# Altium project PCB_Project.PrjPcb
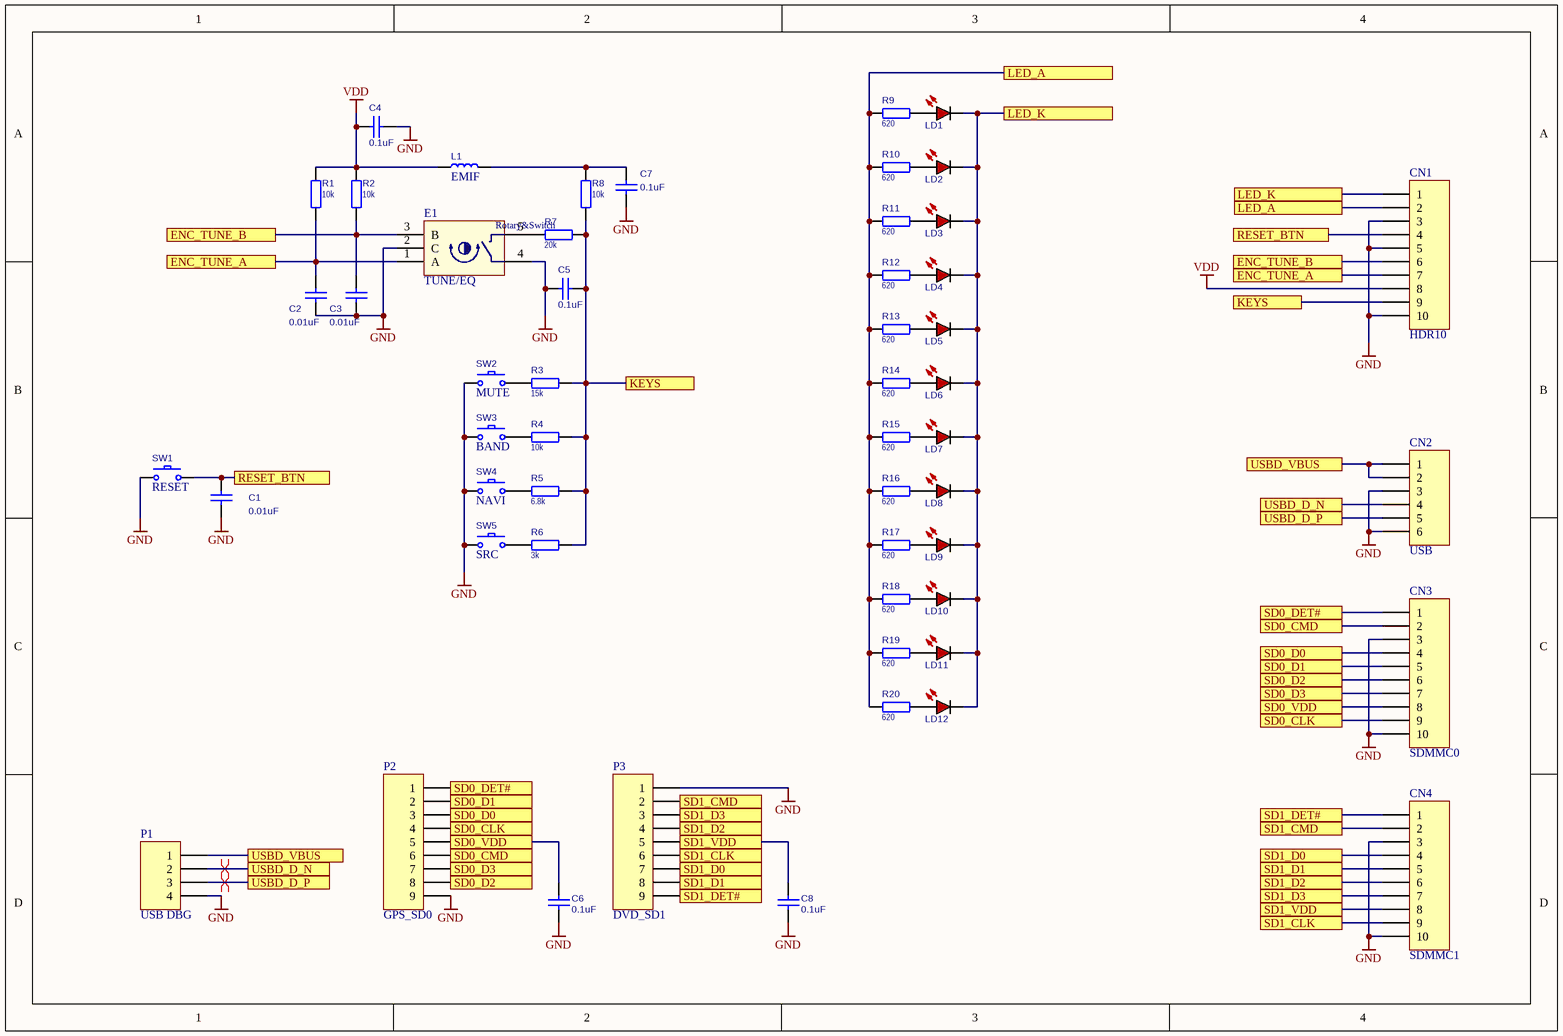
[diagram p0: right_panel.SchDoc]
1 sheet, 54 parts. Net scope: flat (ports and power ports of the same name join across sheets).
Board file: PCB.PcbDoc

## Sheet right_panel.SchDoc
size A4

### Parts
C1  value 0.01uF  [C0603]  (hidden comment: CL10B103KB8NNNC)
C2  value 0.01uF  [C0603]  (hidden comment: CL10B103KB8NNNC)
C3  value 0.01uF  [C0603]  (hidden comment: CL10B103KB8NNNC)
C4  value 0.1uF  [C0603]  (hidden comment: CC0603KRX7R9BB104)
C5  value 0.1uF  [C0603]  (hidden comment: C1608X7R1H104K080AA)
C6  value 0.1uF  [C0603]  (hidden comment: C1608X7R1H104K080AA)
C7  value 0.1uF  [C0603]  (hidden comment: C1608X7R1H104K080AA)
C8  value 0.1uF  [C0603]  (hidden comment: C1608X7R1H104K080AA)
CN1  HDR10  [10S-0.5SH]
CN2  USB  [6S-0.5SH]
CN3  SDMMC0  [10S-0.5SH]
CN4  SDMMC1  [10S-0.5SH]
E1  TUNE/EQ  [Rotary Encoder]
L1  value EMIF  [IND0603]  (hidden comment: BLM18AG102SN1D)
LD1  LED_R  [LED0805]  (value not drawn)
LD2  LED_R  [LED0805]  (value not drawn)
LD3  LED_R  [LED0805]  (value not drawn)
LD4  LED_R  [LED0805]  (value not drawn)
LD5  LED_R  [LED0805]  (value not drawn)
LD6  LED_R  [LED0805]  (value not drawn)
LD7  LED_R  [LED0805]  (value not drawn)
LD8  LED_R  [LED0805]  (value not drawn)
LD9  LED_R  [LED0805]  (value not drawn)
LD10  LED_R  [LED0805]  (value not drawn)
LD11  LED_R  [LED0805]  (value not drawn)
LD12  LED_R  [LED0805]  (value not drawn)
P1  USB DBG  [CUSTOM-4-PADS-2.54]
P2  GPS_SD0  [CUSTOM-9-PADS-1.5]
P3  DVD_SD1  [CUSTOM-9-PADS-1.5]
R1  10k  [R0603]
R2  10k  [R0603]
R3  15k  [R0603]
R4  10k  [R0603]
R5  6.8k  [R0603]
R6  3k  [R0603]
R7  20k  [R0603]
R8  10k  [R0603]
R9  620  [R0603]
R10  620  [R0603]
R11  620  [R0603]
R12  620  [R0603]
R13  620  [R0603]
R14  620  [R0603]
R15  620  [R0603]
R16  620  [R0603]
R17  620  [R0603]
R18  620  [R0603]
R19  620  [R0603]
R20  620  [R0603]
SW1  RESET  [TACTM-34N-F]
SW2  MUTE  [6X6-SMT-2PIN]
SW3  BAND  [6X6-SMT-2PIN]
SW4  NAVI  [6X6-SMT-2PIN]
SW5  SRC  [6X6-SMT-2PIN]

### Ports
ENC_TUNE_A, ENC_TUNE_B, KEYS, LED_A, LED_K, RESET_BTN, SD0_CLK, SD0_CMD, SD0_D0, SD0_D1, SD0_D2, SD0_D3, SD0_DET#, SD0_VDD, SD1_CLK, SD1_CMD, SD1_D0, SD1_D1, SD1_D2, SD1_D3, SD1_DET#, SD1_VDD, USBD_D_N, USBD_D_P, USBD_VBUS

### Nets
GND: C1.1 C2.1 C3.1 C4.2 C5.1 C6.1 C7.2 C8.1 CN1.3 CN1.5 CN1.10 CN2.3 CN2.6 CN3.3 CN3.10 CN4.3 CN4.10 E1.2(C) E1.4(SW) P1.4 P2.9 P3.1 SW1.1 SW2.1 SW3.1 SW4.1 SW5.1
VDD: C4.1 CN1.8 L1.2 R1.2 R2.1
ENC_TUNE_A: C2.2 CN1.7 E1.1(A) R1.1 ; port ENC_TUNE_A
ENC_TUNE_B: C3.2 CN1.6 E1.3(B) R2.2 ; port ENC_TUNE_B
KEYS: C5.2 CN1.9 R3.2 R4.2 R5.2 R6.2 R7.1 R8.1 ; port KEYS
LED_A: CN1.2 R9.1 R10.1 R11.1 R12.1 R13.1 R14.1 R15.1 R16.1 R17.1 R18.1 R19.1 R20.1 ; port LED_A
LED_K: CN1.1 LD1.1 LD2.1 LD3.1 LD4.1 LD5.1 LD6.1 LD7.1 LD8.1 LD9.1 LD10.1 LD11.1 LD12.1 ; port LED_K
RESET_BTN: C1.2 CN1.4 SW1.2 ; port RESET_BTN
SD0_CLK: CN3.9 P2.4 ; port SD0_CLK
SD0_CMD: CN3.2 P2.6 ; port SD0_CMD
SD0_D0: CN3.4 P2.3 ; port SD0_D0
SD0_D1: CN3.5 P2.2 ; port SD0_D1
SD0_D2: CN3.6 P2.8 ; port SD0_D2
SD0_D3: CN3.7 P2.7 ; port SD0_D3
SD0_DET#: CN3.1 P2.1 ; port SD0_DET#
SD0_VDD: C6.2 CN3.8 P2.5 ; port SD0_VDD
SD1_CLK: CN4.9 P3.6 ; port SD1_CLK
SD1_CMD: CN4.2 P3.2 ; port SD1_CMD
SD1_D0: CN4.4 P3.7 ; port SD1_D0
SD1_D1: CN4.5 P3.8 ; port SD1_D1
SD1_D2: CN4.6 P3.4 ; port SD1_D2
SD1_D3: CN4.7 P3.3 ; port SD1_D3
SD1_DET#: CN4.1 P3.9 ; port SD1_DET#
SD1_VDD: C8.2 CN4.8 P3.5 ; port SD1_VDD
USBD_D_N: CN2.4 P1.2 ; port USBD_D_N
USBD_D_P: CN2.5 P1.3 ; port USBD_D_P
USBD_VBUS: CN2.1 CN2.2 P1.1 ; port USBD_VBUS
NetC7_1: C7.1 L1.1 R8.2
NetE1_5: E1.5(SW) R7.2
NetLD1_2: LD1.2 R9.2
NetLD2_2: LD2.2 R10.2
NetLD3_2: LD3.2 R11.2
NetLD4_2: LD4.2 R12.2
NetLD5_2: LD5.2 R13.2
NetLD6_2: LD6.2 R14.2
NetLD7_2: LD7.2 R15.2
NetLD8_2: LD8.2 R16.2
NetLD9_2: LD9.2 R17.2
NetLD10_2: LD10.2 R18.2
NetLD11_2: LD11.2 R19.2
NetLD12_2: LD12.2 R20.2
NetR3_1: R3.1 SW2.2
NetR4_1: R4.1 SW3.2
NetR5_1: R5.1 SW4.2
NetR6_1: R6.1 SW5.2

### Layout directives
differential pair: USBD_D_N, USBD_D_P

### Notes on the sheet
- (in symbol ENC_SW) Rotary&Switch

### Library data of the parts
C1-C8 = CAP_NPOL
CN1 CN3 CN4 = HDR 10: Header, 10-Pin; LatestRevisionDate: 17-Jul-2002; LatestRevisionNote: Re-released for DXP Platform.; Publisher: Altium Limited
CN2 = HDR 6: Header, 6-Pin; LatestRevisionDate: 17-Jul-2002; LatestRevisionNote: Re-released for DXP Platform.; Publisher: Altium Limited
E1 = ENC_SW
L1 = IND_WO_IRON
LD1-LD12 = LED_RED: LED Red; Value: *
P1 = HDR 4: Header, 4-Pin; LatestRevisionDate: 17-Jul-2002; LatestRevisionNote: Re-released for DXP Platform.; Publisher: Altium Limited
P2 P3 = HDR 9: Header, 9-Pin; LatestRevisionDate: 17-Jul-2002; LatestRevisionNote: Re-released for DXP Platform.; Publisher: Altium Limited
R1-R20 = RESISTOR: RES
  R1 R2 R4 R8: Value: 10k
  R3: Value: 15k
  R5: Value: 6.8k
  R6: Value: 3k
  R7: Value: 20k
  R9-R20: Value: 620
SW1-SW5 = SW tact 2-pin: Microswitches, DTSMB-3 series; Value: SW tact 2-pin